# Altium schematic sheet Inverter.SchDoc
size 431 x 279 mm; SheetNumber: 1; SheetTotal: 6
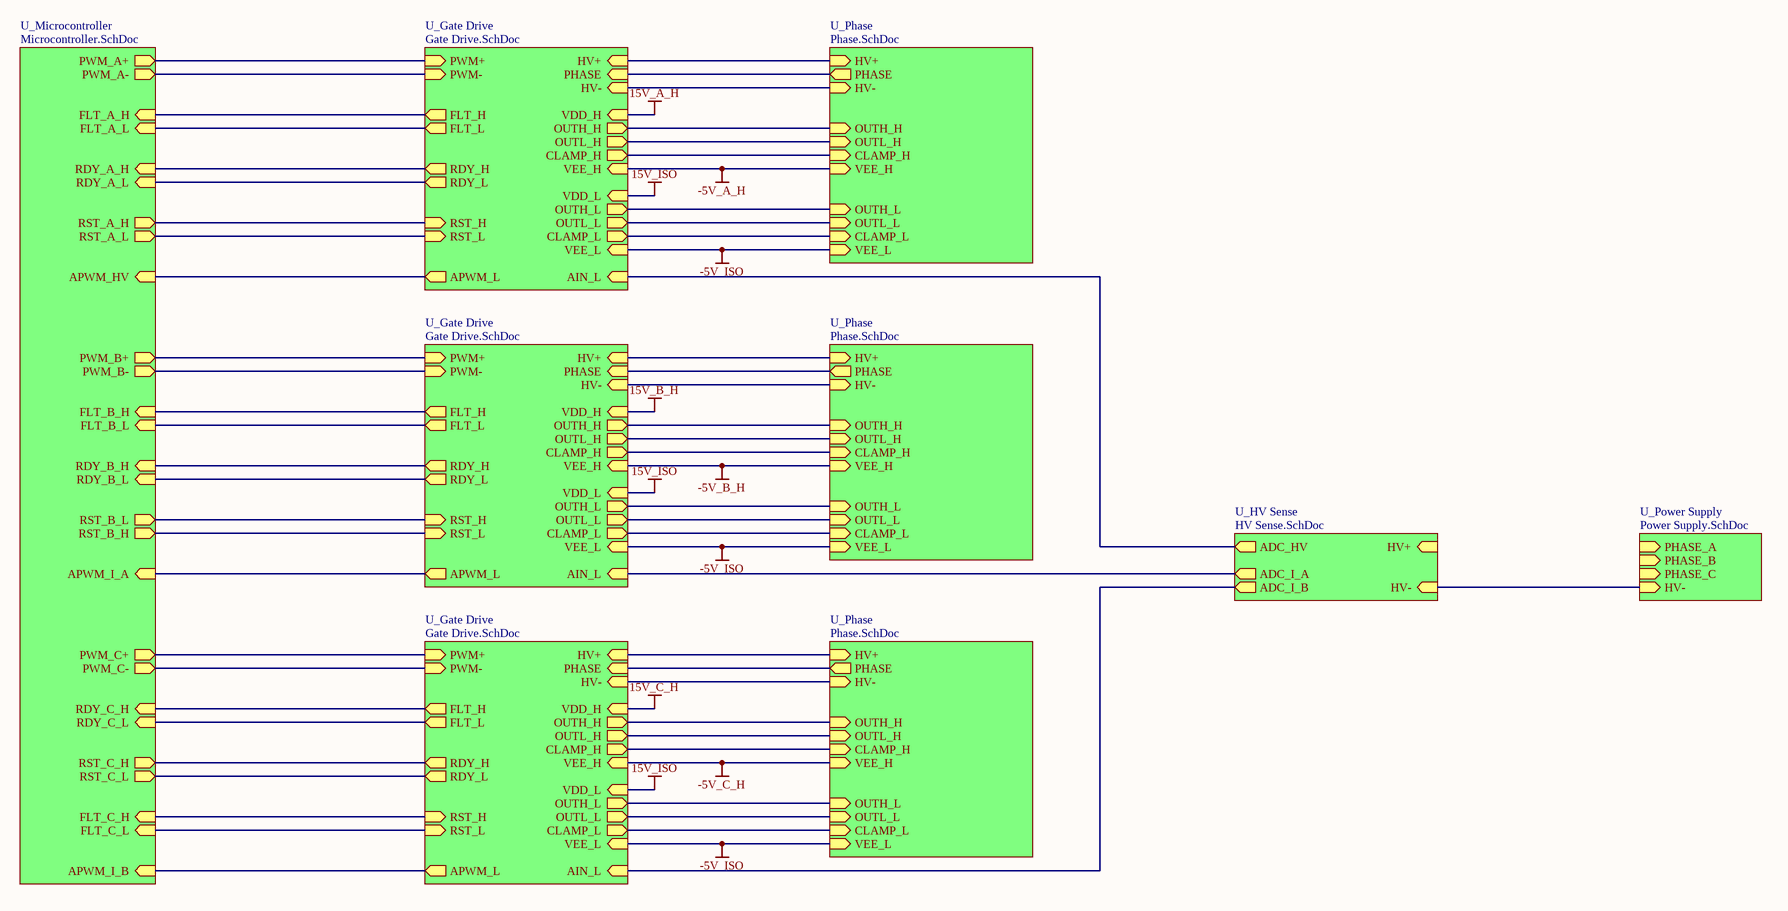
[diagram p0: Inverter.SchDoc]

## Sub-sheets
U_Gate Drive = Gate Drive.SchDoc: PWM+ (in), PWM- (in), FLT_H (out), RDY_H (out), RST_H (in), OUTL_H (out), OUTH_H (out), CLAMP_H (out), FLT_L (out), OUTL_L (out), OUTH_L (out), CLAMP_L (out), RDY_L (out), HV- (in), RST_L (in), HV+ (in), PHASE (in), VEE_L (in), VDD_L (in), VDD_H (in), VEE_H (in), AIN_L (in), APWM_L (out)
U_Gate Drive = Gate Drive.SchDoc: PWM+ (in), PWM- (in), FLT_H (out), RDY_H (out), RST_H (in), OUTL_H (out), OUTH_H (out), CLAMP_H (out), FLT_L (out), OUTL_L (out), OUTH_L (out), CLAMP_L (out), RDY_L (out), HV- (in), RST_L (in), HV+ (in), PHASE (in), VEE_L (in), VDD_L (in), VDD_H (in), VEE_H (in), AIN_L (in), APWM_L (out)
U_Gate Drive = Gate Drive.SchDoc: PWM+ (in), PWM- (in), FLT_H (out), RDY_H (out), RST_H (in), OUTL_H (out), OUTH_H (out), CLAMP_H (out), FLT_L (out), OUTL_L (out), OUTH_L (out), CLAMP_L (out), RDY_L (out), HV- (in), RST_L (in), HV+ (in), PHASE (in), VEE_L (in), VDD_L (in), VDD_H (in), VEE_H (in), AIN_L (in), APWM_L (out)
U_HV Sense = HV Sense.SchDoc: HV- (in), HV+ (in), ADC_HV (out), ADC_I_A (out), ADC_I_B (out)
U_Microcontroller = Microcontroller.SchDoc: PWM_A+ (out), PWM_A- (out), PWM_B+ (out), PWM_B- (out), PWM_C+ (out), PWM_C- (out), FLT_A_L (in), FLT_A_H (in), FLT_B_L (in), FLT_B_H (in), FLT_C_L (in), FLT_C_H (in), RDY_A_L (in), RDY_A_H (in), RDY_B_L (in), RDY_B_H (in), RDY_C_L (in), RDY_C_H (in), RST_A_L (out), RST_A_H (out), RST_B_L (out), RST_B_H (out), RST_C_L (out), RST_C_H (out), APWM_I_A (in), APWM_HV (in), APWM_I_B (in)
U_Phase = Phase.SchDoc: OUTH_H (in), OUTL_H (in), PHASE (out), CLAMP_H (in), VEE_H (in), OUTH_L (in), OUTL_L (in), CLAMP_L (in), VEE_L (in), HV+ (in), HV- (in)
U_Phase = Phase.SchDoc: OUTH_H (in), OUTL_H (in), PHASE (out), CLAMP_H (in), VEE_H (in), OUTH_L (in), OUTL_L (in), CLAMP_L (in), VEE_L (in), HV+ (in), HV- (in)
U_Phase = Phase.SchDoc: OUTH_H (in), OUTL_H (in), PHASE (out), CLAMP_H (in), VEE_H (in), OUTH_L (in), OUTL_L (in), CLAMP_L (in), VEE_L (in), HV+ (in), HV- (in)
U_Power Supply = Power Supply.SchDoc: PHASE_A (in), PHASE_B (in), PHASE_C (in), HV- (in)

## Nets
15V_A_H: sheet U_Gate Drive/VDD_H
15V_B_H: sheet U_Gate Drive/VDD_H
15V_C_H: sheet U_Gate Drive/VDD_H
15V_ISO: sheet U_Gate Drive/VDD_L, sheet U_Gate Drive/VDD_L, sheet U_Gate Drive/VDD_L
-5V_A_H: sheet U_Phase/VEE_H, sheet U_Gate Drive/VEE_H
-5V_B_H: sheet U_Phase/VEE_H, sheet U_Gate Drive/VEE_H
-5V_C_H: sheet U_Phase/VEE_H, sheet U_Gate Drive/VEE_H
-5V_ISO: sheet U_Phase/VEE_L, sheet U_Gate Drive/VEE_L, sheet U_Phase/VEE_L, sheet U_Gate Drive/VEE_L, sheet U_Phase/VEE_L, sheet U_Gate Drive/VEE_L
(unnamed): sheet U_Phase/OUTH_H, sheet U_Gate Drive/OUTH_H
(unnamed): sheet U_Phase/OUTL_H, sheet U_Gate Drive/OUTL_H
(unnamed): sheet U_Phase/PHASE, sheet U_Gate Drive/PHASE
(unnamed): sheet U_Phase/CLAMP_H, sheet U_Gate Drive/CLAMP_H
(unnamed): sheet U_Phase/OUTH_L, sheet U_Gate Drive/OUTH_L
(unnamed): sheet U_Phase/OUTL_L, sheet U_Gate Drive/OUTL_L
(unnamed): sheet U_Phase/CLAMP_L, sheet U_Gate Drive/CLAMP_L
(unnamed): sheet U_Phase/HV+, sheet U_Gate Drive/HV+
(unnamed): sheet U_Phase/HV-, sheet U_Gate Drive/HV-
(unnamed): sheet U_Gate Drive/PWM+, sheet U_Microcontroller/PWM_A+
(unnamed): sheet U_Gate Drive/PWM-, sheet U_Microcontroller/PWM_A-
(unnamed): sheet U_Gate Drive/FLT_H, sheet U_Microcontroller/FLT_A_H
(unnamed): sheet U_Gate Drive/RDY_H, sheet U_Microcontroller/RDY_A_H
(unnamed): sheet U_Gate Drive/RST_H, sheet U_Microcontroller/RST_A_H
(unnamed): sheet U_Gate Drive/FLT_L, sheet U_Microcontroller/FLT_A_L
(unnamed): sheet U_Gate Drive/RDY_L, sheet U_Microcontroller/RDY_A_L
(unnamed): sheet U_Gate Drive/RST_L, sheet U_Microcontroller/RST_A_L
(unnamed): sheet U_Gate Drive/AIN_L, sheet U_HV Sense/ADC_HV
(unnamed): sheet U_Gate Drive/APWM_L, sheet U_Microcontroller/APWM_HV
(unnamed): sheet U_Power Supply/HV-, sheet U_HV Sense/HV-
(unnamed): sheet U_HV Sense/ADC_I_A, sheet U_Gate Drive/AIN_L
(unnamed): sheet U_HV Sense/ADC_I_B, sheet U_Gate Drive/AIN_L
(unnamed): sheet U_Phase/OUTH_H, sheet U_Gate Drive/OUTH_H
(unnamed): sheet U_Phase/OUTL_H, sheet U_Gate Drive/OUTL_H
(unnamed): sheet U_Phase/PHASE, sheet U_Gate Drive/PHASE
(unnamed): sheet U_Phase/CLAMP_H, sheet U_Gate Drive/CLAMP_H
(unnamed): sheet U_Phase/OUTH_L, sheet U_Gate Drive/OUTH_L
(unnamed): sheet U_Phase/OUTL_L, sheet U_Gate Drive/OUTL_L
(unnamed): sheet U_Phase/CLAMP_L, sheet U_Gate Drive/CLAMP_L
(unnamed): sheet U_Phase/HV+, sheet U_Gate Drive/HV+
(unnamed): sheet U_Phase/HV-, sheet U_Gate Drive/HV-
(unnamed): sheet U_Gate Drive/PWM+, sheet U_Microcontroller/PWM_B+
(unnamed): sheet U_Gate Drive/PWM-, sheet U_Microcontroller/PWM_B-
(unnamed): sheet U_Gate Drive/FLT_H, sheet U_Microcontroller/FLT_B_H
(unnamed): sheet U_Gate Drive/RDY_H, sheet U_Microcontroller/RDY_B_H
(unnamed): sheet U_Gate Drive/RST_H, sheet U_Microcontroller/RST_B_L
(unnamed): sheet U_Gate Drive/FLT_L, sheet U_Microcontroller/FLT_B_L
(unnamed): sheet U_Gate Drive/RDY_L, sheet U_Microcontroller/RDY_B_L
(unnamed): sheet U_Gate Drive/RST_L, sheet U_Microcontroller/RST_B_H
(unnamed): sheet U_Gate Drive/APWM_L, sheet U_Microcontroller/APWM_I_A
(unnamed): sheet U_Phase/OUTH_H, sheet U_Gate Drive/OUTH_H
(unnamed): sheet U_Phase/OUTL_H, sheet U_Gate Drive/OUTL_H
(unnamed): sheet U_Phase/PHASE, sheet U_Gate Drive/PHASE
(unnamed): sheet U_Phase/CLAMP_H, sheet U_Gate Drive/CLAMP_H
(unnamed): sheet U_Phase/OUTH_L, sheet U_Gate Drive/OUTH_L
(unnamed): sheet U_Phase/OUTL_L, sheet U_Gate Drive/OUTL_L
(unnamed): sheet U_Phase/CLAMP_L, sheet U_Gate Drive/CLAMP_L
(unnamed): sheet U_Phase/HV+, sheet U_Gate Drive/HV+
(unnamed): sheet U_Phase/HV-, sheet U_Gate Drive/HV-
(unnamed): sheet U_Gate Drive/PWM+, sheet U_Microcontroller/PWM_C+
(unnamed): sheet U_Gate Drive/PWM-, sheet U_Microcontroller/PWM_C-
(unnamed): sheet U_Gate Drive/FLT_H, sheet U_Microcontroller/RDY_C_H
(unnamed): sheet U_Gate Drive/RDY_H, sheet U_Microcontroller/RST_C_H
(unnamed): sheet U_Gate Drive/RST_H, sheet U_Microcontroller/FLT_C_H
(unnamed): sheet U_Gate Drive/FLT_L, sheet U_Microcontroller/RDY_C_L
(unnamed): sheet U_Gate Drive/RDY_L, sheet U_Microcontroller/RST_C_L
(unnamed): sheet U_Gate Drive/RST_L, sheet U_Microcontroller/FLT_C_L
(unnamed): sheet U_Gate Drive/APWM_L, sheet U_Microcontroller/APWM_I_B

## Notes on the sheet
- Title
- Project
- Scale
- Size
- B
- Part Number
- Engineer
- Sheet
- of
- Rev